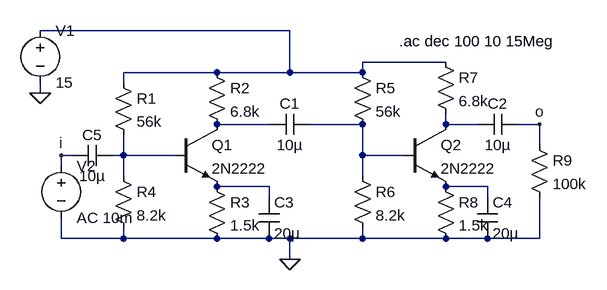
[diagram p0: schematic rc_coupled_amp.asc]
rc_coupled_amp.asc, the LTspice schematic file:
Version 4
SHEET 1 880 680
WIRE 304 -48 -80 -48
WIRE 544 0 416 0
WIRE 192 16 48 16
WIRE 304 16 304 -48
WIRE 304 16 192 16
WIRE 416 16 416 0
WIRE 416 16 304 16
WIRE 48 32 48 16
WIRE -80 48 -80 32
WIRE 272 96 192 96
WIRE 416 96 336 96
WIRE 544 96 544 80
WIRE 592 96 544 96
WIRE 688 96 656 96
WIRE 688 128 688 96
WIRE -32 144 -48 144
WIRE 48 144 48 112
WIRE 48 144 32 144
WIRE 128 144 48 144
WIRE 416 144 416 96
WIRE 480 144 416 144
WIRE -48 160 -48 144
WIRE 48 176 48 144
WIRE 416 176 416 144
WIRE 272 192 192 192
WIRE 608 192 544 192
WIRE 272 208 272 192
WIRE 608 208 608 192
WIRE -48 272 -48 240
WIRE 48 272 48 256
WIRE 48 272 -48 272
WIRE 192 272 48 272
WIRE 272 272 192 272
WIRE 304 272 272 272
WIRE 416 272 416 256
WIRE 416 272 304 272
WIRE 544 272 416 272
WIRE 608 272 544 272
WIRE 688 272 688 208
WIRE 688 272 608 272
WIRE 304 304 304 272
FLAG -80 48 0
FLAG 304 304 0
FLAG -48 144 i
FLAG 688 96 o
SYMBOL res 32 16 R0
SYMATTR InstName R1
SYMATTR Value 56k
SYMBOL res 176 0 R0
SYMATTR InstName R2
SYMATTR Value 6.8k
SYMBOL res 176 176 R0
SYMATTR InstName R3
SYMATTR Value 1.5k
SYMBOL res 32 160 R0
SYMATTR InstName R4
SYMATTR Value 8.2k
SYMBOL npn 128 96 R0
SYMATTR InstName Q1
SYMATTR Value 2N2222
SYMBOL cap 336 80 R90
WINDOW 0 0 32 VBottom 2
WINDOW 3 32 32 VTop 2
SYMATTR InstName C1
SYMATTR Value 10µ
SYMBOL res 400 0 R0
SYMATTR InstName R5
SYMATTR Value 56k
SYMBOL res 400 160 R0
SYMATTR InstName R6
SYMATTR Value 8.2k
SYMBOL res 528 -16 R0
SYMATTR InstName R7
SYMATTR Value 6.8k
SYMBOL res 528 176 R0
SYMATTR InstName R8
SYMATTR Value 1.5k
SYMBOL npn 480 96 R0
SYMATTR InstName Q2
SYMATTR Value 2N2222
SYMBOL voltage -80 -64 R0
SYMATTR InstName V1
SYMATTR Value 15
SYMBOL voltage -48 144 R0
SYMATTR InstName V2
SYMATTR Value AC 10m
SYMBOL cap 656 80 R90
WINDOW 0 0 32 VBottom 2
WINDOW 3 32 32 VTop 2
SYMATTR InstName C2
SYMATTR Value 10µ
SYMBOL res 672 112 R0
SYMATTR InstName R9
SYMATTR Value 100k
SYMBOL cap 256 208 R0
SYMATTR InstName C3
SYMATTR Value 20µ
SYMBOL cap 592 208 R0
SYMATTR InstName C4
SYMATTR Value 20µ
SYMBOL cap 32 128 R90
WINDOW 0 0 32 VBottom 2
WINDOW 3 32 32 VTop 2
SYMATTR InstName C5
SYMATTR Value 10µ
TEXT 472 -32 Left 2 !.ac dec 100 10 15Meg

The netlist it stands for:
* rc_coupled_amp.asc
R1 N001 N005 56k
R2 N001 N002 6.8k
R3 N006 0 1.5k
R4 N005 0 8.2k
Q1 N002 N005 N006 0 2N2222
C1 N003 N002 10µ
R5 N001 N003 56k
R6 N003 0 8.2k
R7 N001 N004 6.8k
R8 N007 0 1.5k
Q2 N004 N003 N007 0 2N2222
V1 N001 0 15
V2 i 0 AC 10m
C2 o N004 10µ
R9 o 0 100k
C3 N006 0 20µ
C4 N007 0 20µ
C5 N005 i 10µ
.model NPN NPN
.model PNP PNP
.lib standard.bjt
.ac dec 100 10 15Meg
.backanno
.end